# EAGLE design atx4vc (EAGLE 9.6.2)
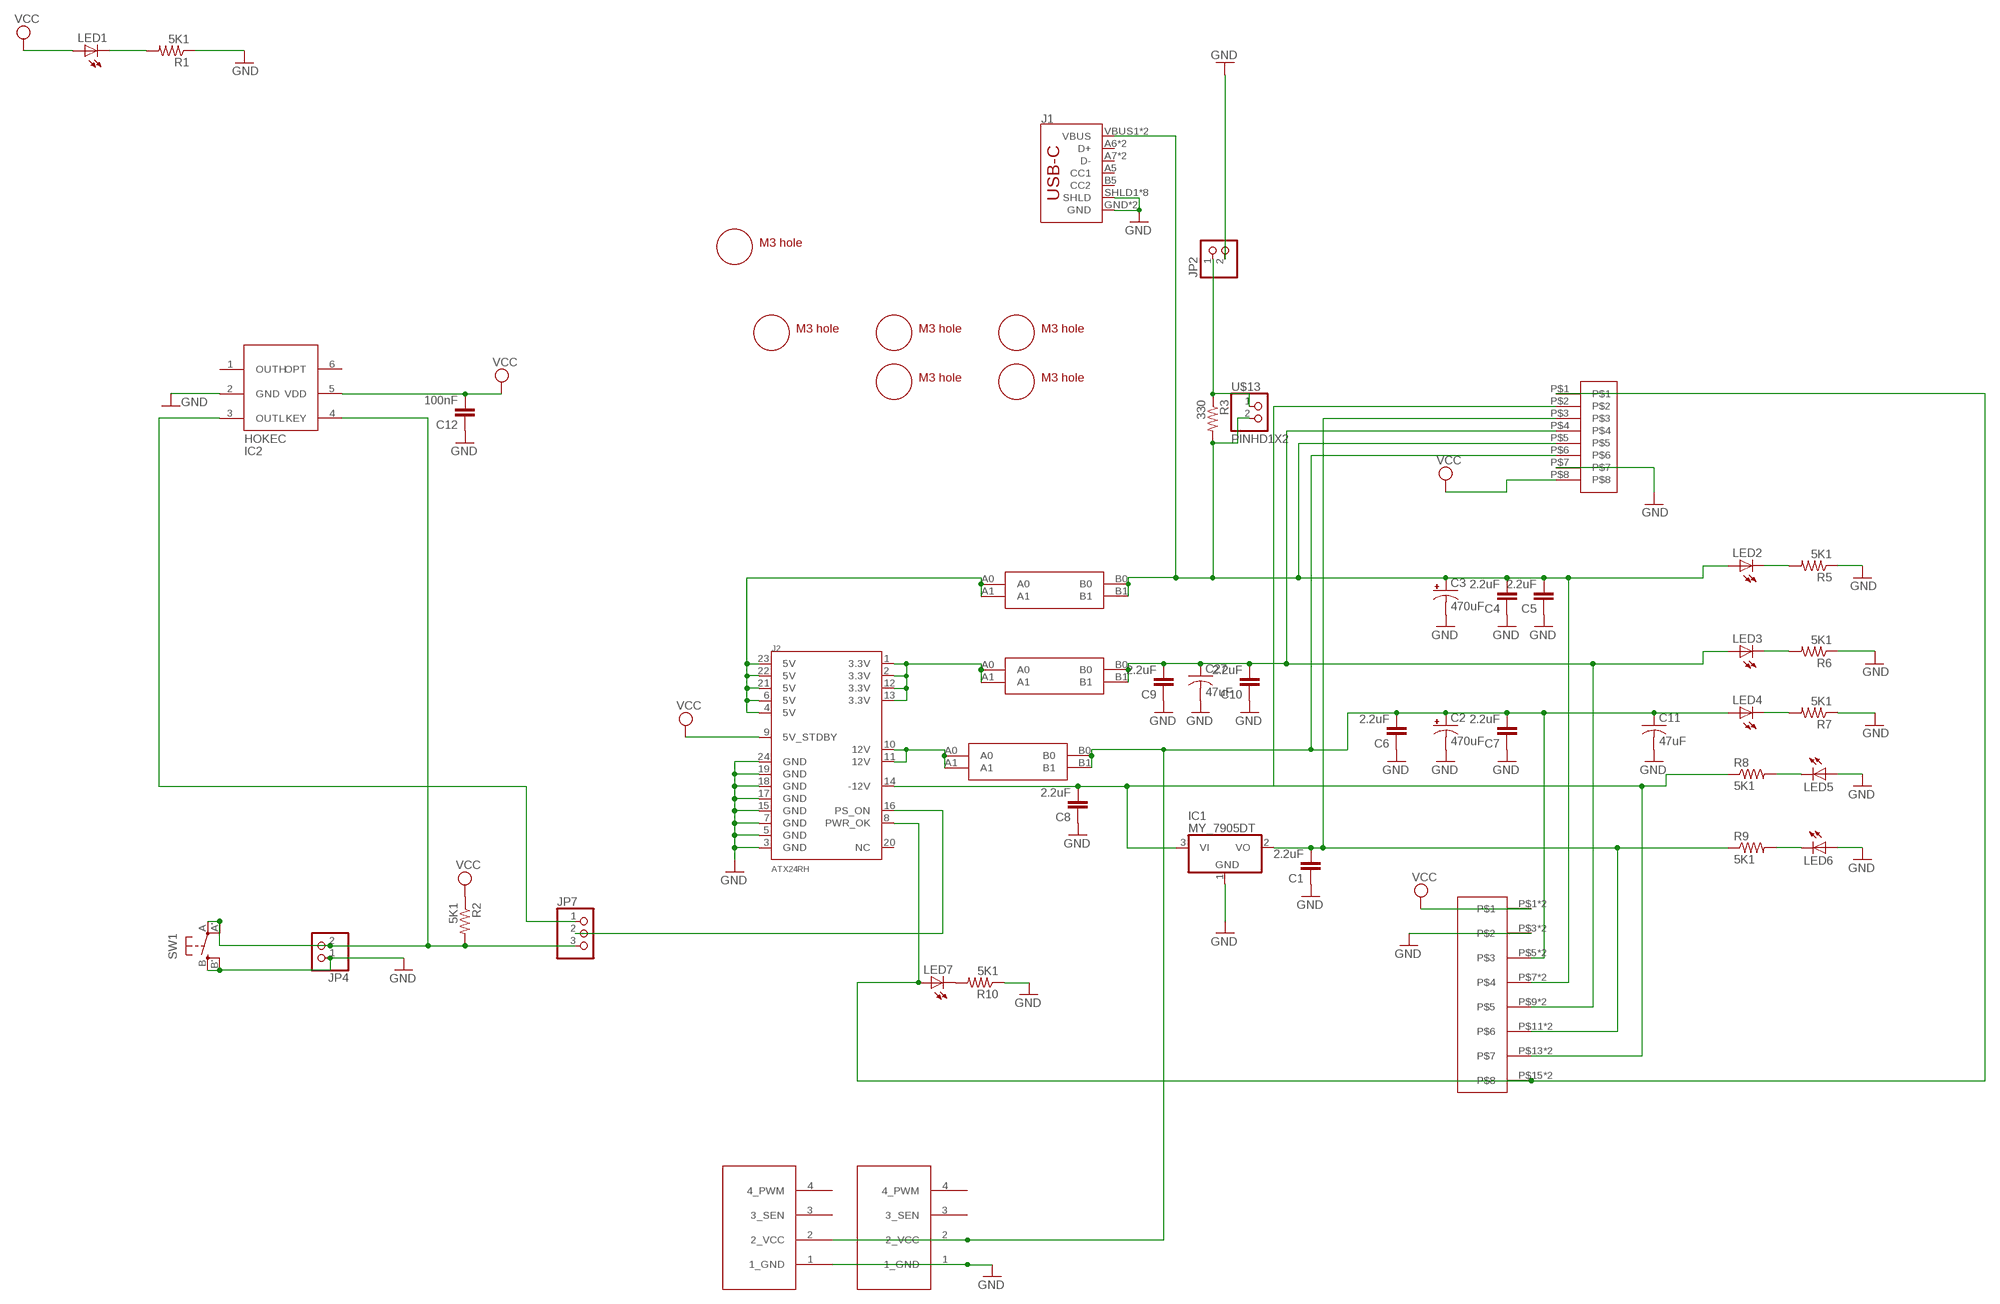
[diagram p0: schematic, sheet 1]

## Parts
C1  2.2uF  CAP0805  [0805$1]
C2  470uF  CPOL-USSMCD  [SMC_D]
C3  470uF  CPOL-USSMCD  [SMC_D]
C4  2.2uF  CAP0805  [0805$1]
C5  2.2uF  CAP0805  [0805$1]
C6  2.2uF  CAP0805  [0805$1]
C7  2.2uF  CAP0805  [0805$1]
C8  2.2uF  CAP0805  [0805$1]
C9  2.2uF  CAP0805  [0805$1]
C10  2.2uF  CAP0805  [0805$1]
C11  47uF  C-USC1210  [C1210]
C12  100nF  CAP0805  [0805$1]
C27  47uF  C-USC1210  [C1210]
IC1  MY_7905DT  [ADAFRUIT_TO252]
IC2  MAX486X/SOT  [SOT23-6]
J1  USB_C16PIN  [USB-C-16P]
J2  ATX24RH  [ATX24_RIGHT_ANGLE]
JP1  4PIN_FAN  [1X04]
JP2  PINHD-1X2  [1X02]
JP4  PINHD-1X2  [1X02]
JP5  4PIN_FAN  [1X04]
JP7  PINHD-1X3CB  [1X03-CLEANBIG]
LED1  LEDCHIP-LED0805  [CHIP-LED0805]
LED2  LEDCHIP-LED0805  [CHIP-LED0805]
LED3  LEDCHIP-LED0805  [CHIP-LED0805]
LED4  LEDCHIP-LED0805  [CHIP-LED0805]
LED5  LEDCHIP-LED0805  [CHIP-LED0805]
LED6  LEDCHIP-LED0805  [CHIP-LED0805]
LED7  LEDCHIP-LED0805  [CHIP-LED0805]
R1  5K1  RESISTOR0805-RES  [0805]
R2  5K1  RESISTOR0805-RES  [0805]
R3  330  RESISTOR0805-RES  [0805]
R5  5K1  RESISTOR0805-RES  [0805]
R6  5K1  RESISTOR0805-RES  [0805]
R7  5K1  RESISTOR0805-RES  [0805]
R8  5K1  RESISTOR0805-RES  [0805]
R9  5K1  RESISTOR0805-RES  [0805]
R10  5K1  RESISTOR0805-RES  [0805]
SW1  SPST_TACT-EVQQ2  [EVQ-Q2]
U$1  M3_MOUNTING_HOLE  [M3_MOUNTING_HOLE_PACK]
U$2  M3_MOUNTING_HOLE  [M3_MOUNTING_HOLE_PACK]
U$3  M3_MOUNTING_HOLE  [M3_MOUNTING_HOLE_PACK]
U$4  M3_MOUNTING_HOLE  [M3_MOUNTING_HOLE_PACK]
U$5  M3_MOUNTING_HOLE  [M3_MOUNTING_HOLE_PACK]
U$6  M3_MOUNTING_HOLE  [M3_MOUNTING_HOLE_PACK]
U$7  396_CONN_VH396_8P  [396_CONN_396_8P]
U$9  CAR_FUSE_HOLDER3IN1  [FUSE_HOLDER_3IN1]
U$10  CAR_FUSE_HOLDER3IN1  [FUSE_HOLDER_3IN1]
U$11  CAR_FUSE_HOLDER3IN1  [FUSE_HOLDER_3IN1]
U$12  DG2204R-5.0-8DG2204-8  [DG2204R-8]
U$13  PINHD1X2  [1X02]

## Nets
-5V: C1.2 IC1.2(VO) R9.1 U$7.P$3 U$12.P$11 U$12.P$12
-12V: C8.2 IC1.3(VI) J2.14(-12V) R8.1 U$7.P$2 U$12.P$13 U$12.P$14
F3V3: C9.2 C10.2 C27.1 LED3.A U$7.P$4 U$10.B0 U$10.B1 U$12.P$9 U$12.P$10
F5V: C3.+ C4.2 C5.2 J1.VBUS1(VBUS) J1.VBUS2(VBUS) LED2.A R3.2 U$7.P$5 U$9.B0 U$9.B1 U$12.P$7 U$12.P$8 U$13.2
F12V: C2.+ C6.2 C7.2 C11.1 JP1.2(2_VCC) JP5.2(2_VCC) LED4.A U$7.P$6 U$11.B0 U$11.B1 U$12.P$5 U$12.P$6
GND: C1.1 C2.- C3.- C4.1 C5.1 C6.1 C7.1 C8.1 C9.1 C10.1 C11.2 C12.1 C27.2 IC1.1(GND) IC2.2(GND) J1.GND J1.GND2(GND) J1.SHLD1(SHLD) J1.SHLD2(SHLD) J1.SHLD3(SHLD) J1.SHLD4(SHLD) J1.SHLD5(SHLD) J1.SHLD6(SHLD) J1.SHLD7(SHLD) J1.SHLD8(SHLD) J2.3(GND) J2.5(GND) J2.7(GND) J2.15(GND) J2.17(GND) J2.18(GND) J2.19(GND) J2.24(GND) JP1.1(1_GND) JP2.2 JP4.1 JP5.1(1_GND) LED5.A LED6.A R1.1 R5.1 R6.1 R7.1 R10.1 SW1.B'(S1) SW1.B(S) U$7.P$7 U$12.P$3 U$12.P$4
N$1: LED7.C R10.2
N$5: LED6.C R9.2
N$6: IC2.3(OUTL) JP7.1
N$8: LED5.C R8.2
N$9: LED4.C R7.2
N$10: J2.4(5V) J2.6(5V) J2.21(5V) J2.22(5V) J2.23(5V) U$9.A0 U$9.A1
N$11: J2.8(PWR_OK) LED7.A U$7.P$1 U$12.P$15 U$12.P$16
N$12: IC2.4(KEY) JP4.2 JP7.3 R2.2 SW1.A'(P1) SW1.A(P)
N$14: J2.1(3.3V) J2.2(3.3V) J2.12(3.3V) J2.13(3.3V) U$10.A0 U$10.A1
N$15: J2.16(PS_ON) JP7.2
N$17: JP2.1 R3.1 U$13.1
N$18: LED3.C R6.2
N$20: LED2.C R5.2
N$21: J2.10(12V) J2.11(12V) U$11.A0 U$11.A1
N$29: LED1.C R1.2
VCC: C12.2 IC2.5(VDD) J2.9(5V_STDBY) LED1.A R2.1 U$7.P$8 U$12.P$1 U$12.P$2
Unconnected: IC2.1(OUTH) IC2.6(OPT) J1.A5(CC1) J1.A6(D+) J1.A7(D-) J1.B5(CC2) J1.B6(D+) J1.B7(D-) J2.20(NC) JP1.3(3_SEN) JP1.4(4_PWM) JP5.3(3_SEN) JP5.4(4_PWM)

## Library data of the parts
C1 C4-C10 C12 = atx_power_control:CAP: Capacitor Standard 0603 ceramic capacitor, and 0.1" leaded capacitor.
C2 C3 = rcl:CPOL-US: POLARIZED CAPACITOR, American symbol; SPICEPREFIX: C
C11 C27 = clock:C-US: CAPACITOR, American symbol
IC1 = atx_power_control:MY_7905: Positive VOLTAGE REGULATOR Added bigger pads to the TO-92 package
IC2 = pmm:MAX486X
J1 = SparkFun-Connectors:USB_C: USB Type C 16Pin Connector Super Speed pins not available on the 16-pin purely SMD connector so this part is best for USB 2.0 implementations. D1 and D2 are tied together enabling D+/- no matter which way the cable is plugged into the connector. The two channel configuration pins (CC1/2) are exposed. These are normally connected to ground via 5.1k resistors but can be reconfigured for high current/high power applications.; PROD_ID: CONN-14122
J2 = nomcu:ATX24: ATX24 Pin Power Supply Connector This is a good connector for connecting a computer power supply to a PCB. It's massive, but provides many amps of power at 5V and 12V. SKU: PRT-09498
JP1 JP5 = appleii:4PIN_FAN: PIN HEADER
JP2 JP4 = pinhead:PINHD-1X2: PIN HEADER
JP7 = adafruit_changed:PINHD-1X3: PIN HEADER
LED1-LED7 = adafruit:LED: LED OSRAM: - CHIPLED LG R971, LG N971, LY N971, LG Q971, LY Q971, LO R971, LY R971 LH N974, LH R974 LS Q976, LO Q976, LY Q976 LO Q996 - Hyper CHIPLED LW Q18S LB Q993, LB Q99A, LB R99A - SideLED LS A670, LO A670, LY A670, LG A670, LP A670 LB A673, LV A673, LT A673, LW A673 LH A674 LY A675 LS A676, LA A676, LO A676, LY A676, LW A676 LS A679, LY A679, LG A679 - Hyper Micro SIDELED® LS Y876, LA Y876, LO Y876, LY Y876 LT Y87S - SmartLED LW L88C, LW L88S LB L89C, LB L89S, LG L890 LS L89K, LO L89K, LY L89K LS L896, LA L896, LO L896, LY L896 - TOPLED LS T670, LO T670, LY T670, LG T670, LP T670 LSG T670, LSP T670, LSY T670, LOP T670, LYG T670 LG T671, LOG T671, LSG T671 LB T673, LV T673, LT T673, LW T673 LH T674 LS T676, LA T676, LO T676, LY T676, LB T676, LH T676, LSB T676, LW T676 LB T67C, LV T67C, LT T67C, LS T67K, LO T67K, LY T67K, LW E67C LS E67B, LA E67B, LO E67B, LY E67B, LB E67C, LV E67C, LT E67C LW T67C LS T679, LY T679, LG T679 LS T770, LO T770, LY T770, LG T770, LP T770 LB T773, LV T773, LT T773, LW T773 LH T774 LS E675, LA E675, LY E675, LS T675 LS T776, LA T776, LO T776, LY T776, LB T776 LHGB T686 LT T68C, LB T68C - Hyper Mini TOPLED® LB M676 - Mini TOPLED Santana® LG M470 LS M47K, LO M47K, LY M47K Source: http://www.osram.convergy.de/
R1-R3 R5-R7 R10 = atx_power_control:RESISTOR: Resistor Basic schematic elements and footprints for 0603, 1206, and PTH resistors.
R8 R9 = SparkFun-Passives:RESISTOR: Resistor Basic schematic elements and footprints for 0603, 1206, and PTH resistors.
SW1 = duckypad:SPST_TACT: SMT 6mm switch, EVQQ2 series http://www.ladyada.net/library/eagle
U$1-U$6 = a:M3_MOUNTING_HOLE
U$7 = atx4vc:396_CONN_VH396_8P
U$9-U$11 = atx_power_control:CAR_FUSE_HOLDER
U$12 = atx4vc:DG2204R-5.0-8
U$13 = adafruit_changed:PINHD1X2

## Board
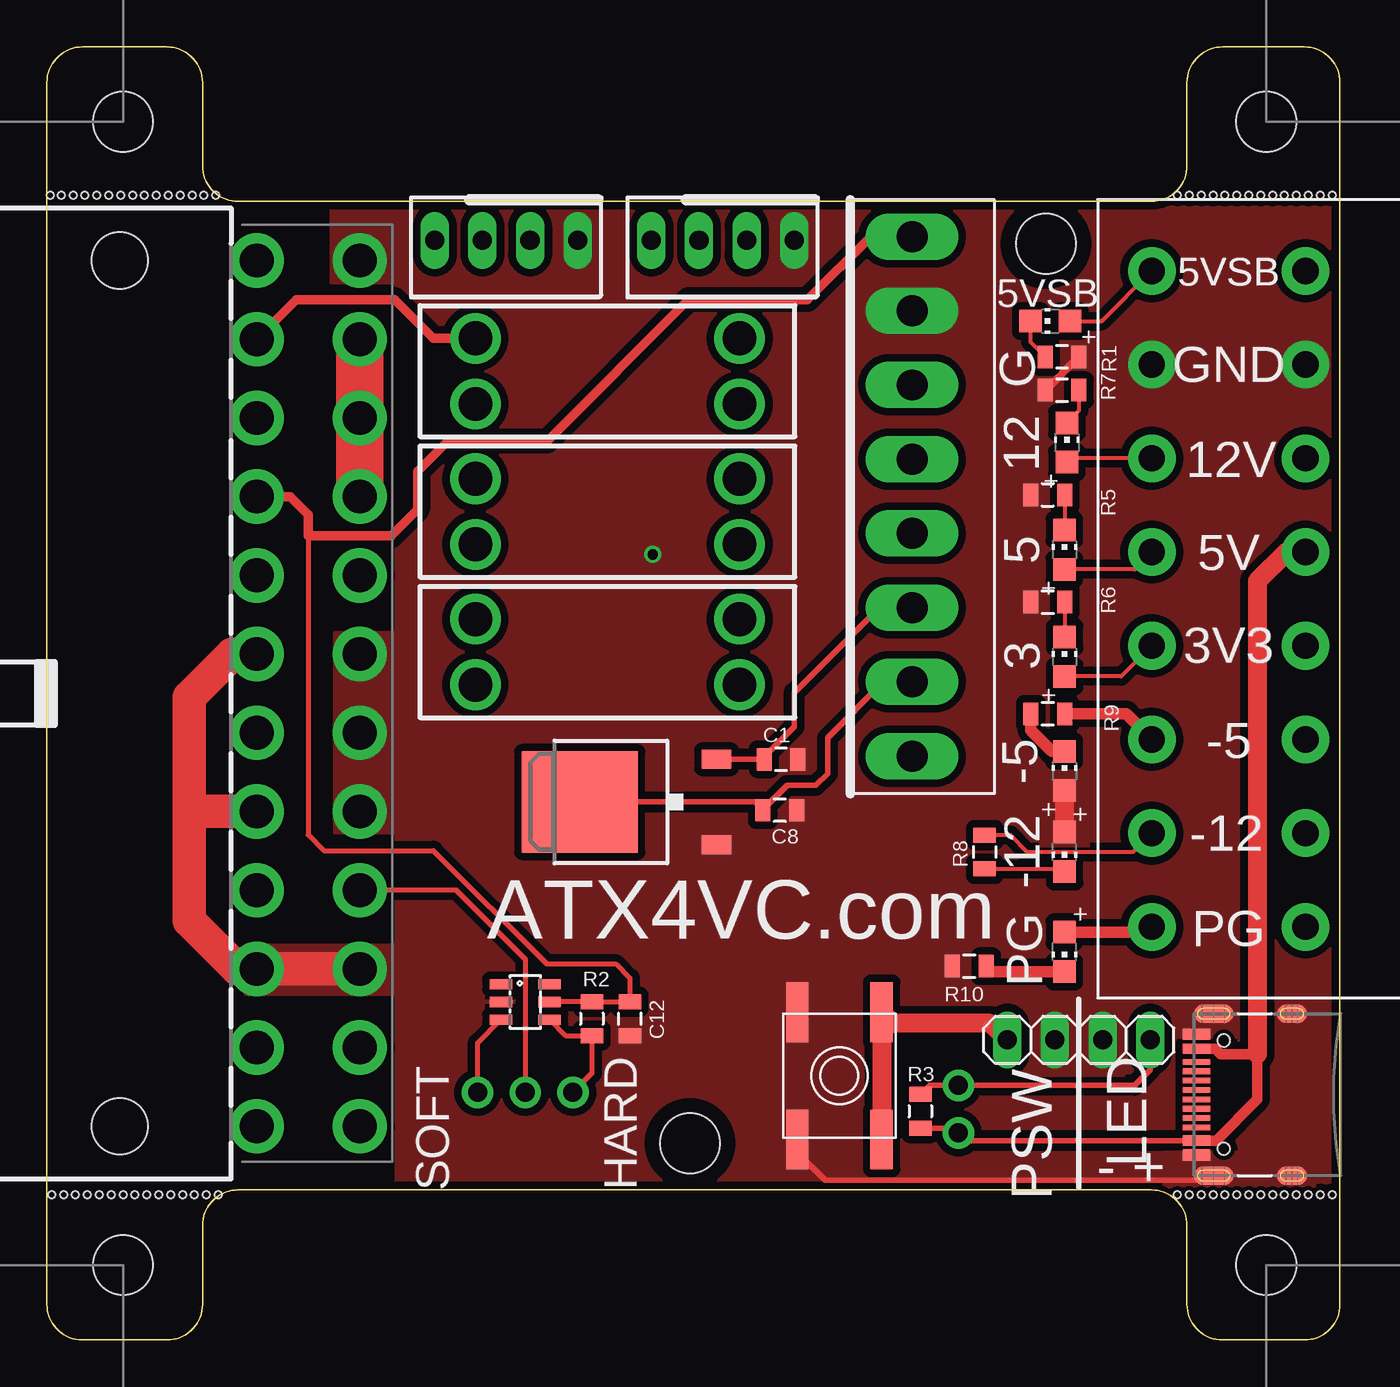
[diagram p1: board, top side]
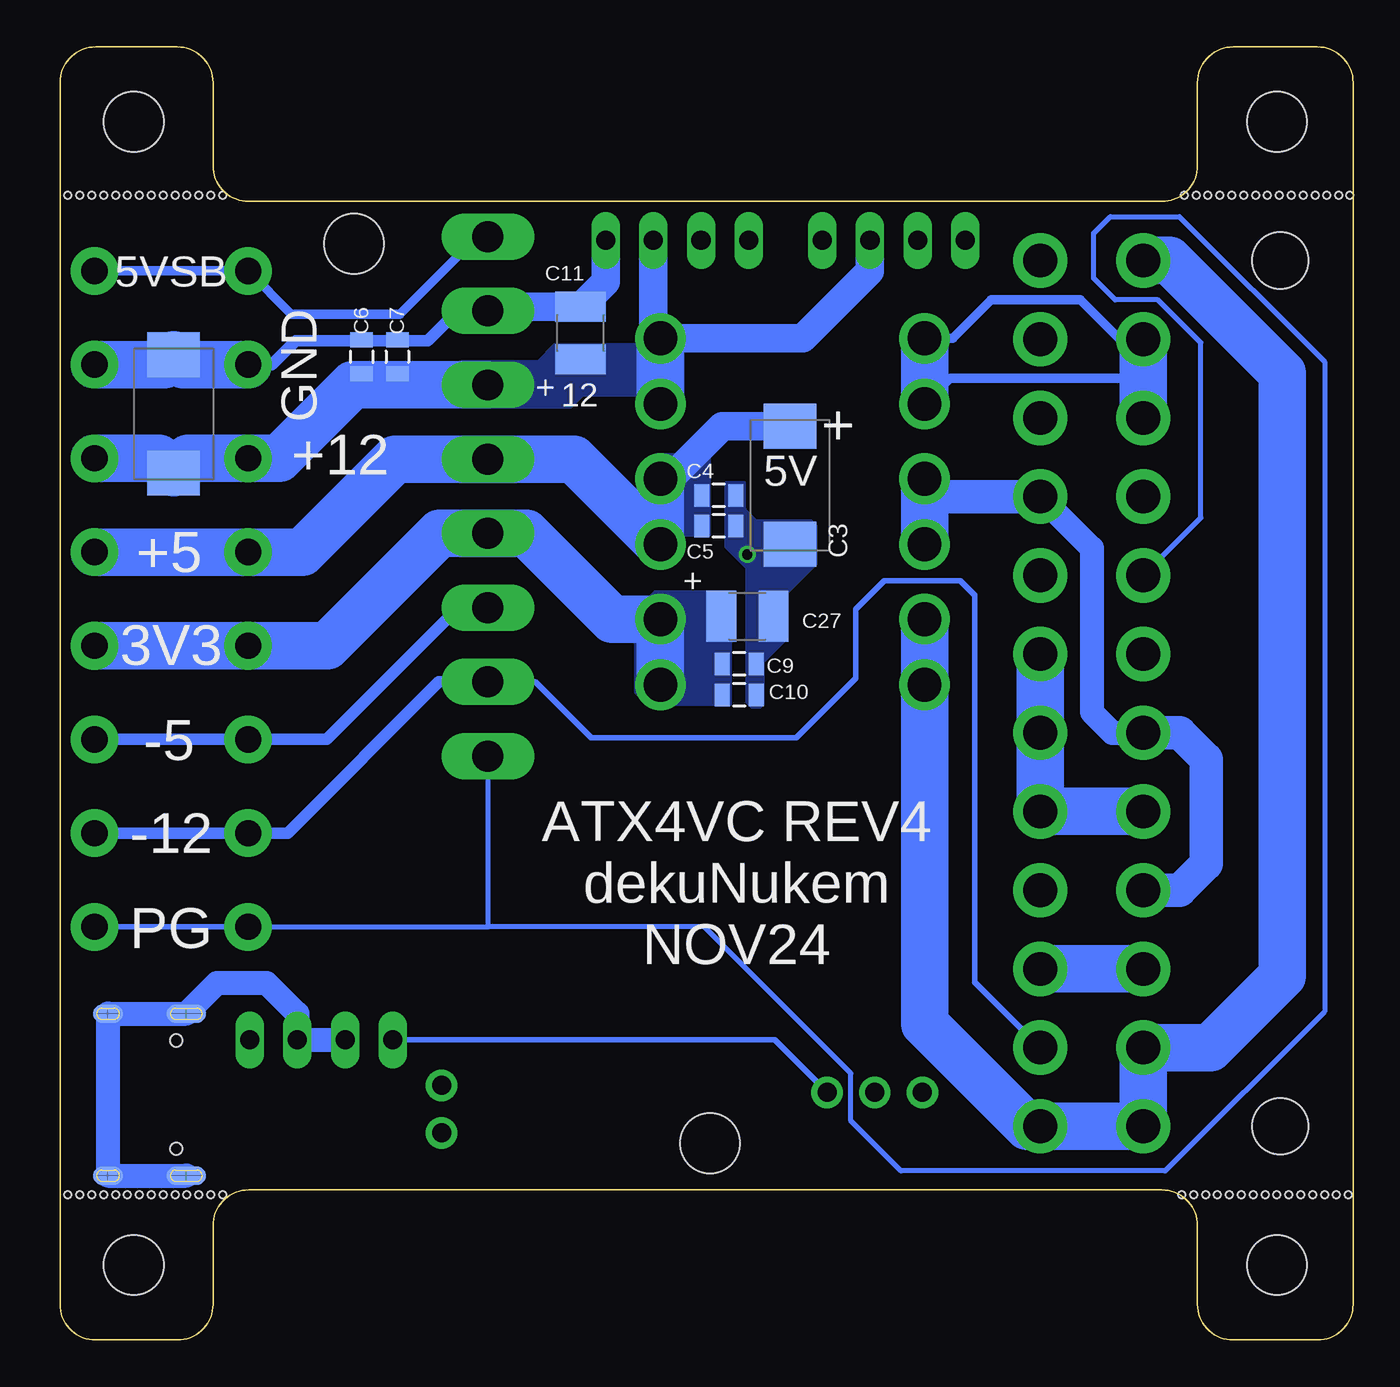
[diagram p2: board, bottom side, seen from below]

Size 69 x 69 mm. Coordinates in mm from the lower left corner, seen from the top.
Outline: 10.21,60.75 58.93,60.75 arc90 60.83,62.66 60.83,67.09 arc-90 62.74,69 67.09,69 arc-90 69,67.09 69,1.91 arc-90 67.09,0 62.74,0 arc-90 60.83,1.91 60.83,6.1 arc90 58.93,8.01 10.21,8.01 arc90 8.31,6.1 8.31,1.91 arc-90 6.4,0 1.91,0 arc-90 0,1.91 0,67.09 arc-90 1.91,69 6.4,69 arc-90 8.31,67.09 8.31,62.66 arc90 10.21,60.75
Copper layers (1*16): Top 0.035mm / dielectric 1.5mm / Bottom 0.035mm
Design rules "deku_2layer_6mil": minimum track width 6mil, minimum drill 15mil, track to track 6mil, track to pad 6mil, pad to pad 6mil, via to via 6mil, smd to smd 6mil, copper to edge 10mil, drill to drill 6mil, minimum pad ring 7mil, minimum via ring 7mil, stop-mask expansion 4mil, vias tented up to drill 25mil, thermal gap 10mil
Holes 0.38 mm at 0.18,61.09 0.76,61.09 1.4,61.09 2.03,61.09 2.67,61.09 3.3,61.09 3.94,61.09 4.57,61.09 5.21,61.09 5.84,61.09 6.48,61.09 7.11,61.09 7.75,61.09 8.38,61.09 0.25,7.75 0.89,7.75 1.52,7.75 2.16,7.75 2.79,7.75 3.43,7.75 4.06,7.75 4.7,7.75 5.33,7.75 5.97,7.75 6.6,7.75 7.24,7.75 7.87,7.75 8.51,7.75 60.33,7.75 60.96,7.75 61.59,7.75 62.23,7.75 62.87,7.75 63.5,7.75 64.14,7.75 64.77,7.75 65.41,7.75 66.04,7.75 66.67,7.75 67.31,7.75 67.94,7.75 68.58,7.75 60.96,61.09 61.59,61.09 62.23,61.09 62.87,61.09 63.5,61.09 64.14,61.09 64.77,61.09 65.41,61.09 66.04,61.09 66.67,61.09 67.31,61.09 67.94,61.09 68.58,61.09 9.14,7.75 9.02,61.09 60.33,61.09
tRestrict: area 0,0 to 8,8; area 0,60.9 to 8,68.9; area 61.1,61.1 to 69.1,69.1; area 61.1,0 to 69.1,8
bRestrict: area 0,0 to 8,8; area 61.1,0 to 69.1,8; area 0,60.9 to 8,68.9; area 61.1,61.1 to 69.1,69.1

### Footprints (pad centres in the part's own frame; a part is rotated, then mirrored left to right if it is on the bottom)
0805$1 = smd 0.8 x 1.2: 1 -0.9,0; 2 0.9,0
SMC_D = smd 2.4 x 2.8: + -3.15,0; - 3.15,0
C1210 = smd 1.6 x 2.7: 1 -1.4,0; 2 1.4,0
ADAFRUIT_TO252 = smd 1 x 1.6: 1 -2.28,-4.8; 2 2.28,-4.8 | smd 5.4 x 6.2: 3 0,2.5
SOT23-6 = smd 0.55 x 1.2: 1 -0.95,-1.3; 2 0,-1.3; 3 0.95,-1.3; 4 0.95,1.3; 5 0,1.3; 6 -0.95,1.3
USB-C-16P = smd 0.3 x 1.45: A5 -1.25,0; A6 -0.25,0; A7 0.25,0; A8 1.25,0; B5 1.75,0; B6 0.75,0; B7 -0.75,0; B8 -1.75,0 | smd 0.6 x 1.45: GND -3.225,0; GND2 3.225,0 | smd 1 x 2.1: SHLD1 -4.32,-0.915; SHLD2 4.32,-0.915 | smd 1 x 2.1 bottom: SHLD3 -4.32,-0.915; SHLD4 4.32,-0.915 | smd 1 x 1.6: SHLD5 -4.32,-5.095; SHLD8 4.32,-5.095 | smd 1 x 1.6 bottom: SHLD6 -4.32,-5.095; SHLD7 4.32,-5.095 | smd 0.55 x 1.45: VBUS1 -2.45,0; VBUS2 2.45,0 | hole 0.65: -2.89,-1.445; 2.89,-1.445
ATX24_RIGHT_ANGLE = drill 1.8 pad 2.9: 1 23.1,4.76; 2 18.9,4.76; 3 14.7,4.76; 4 10.5,4.76; 5 6.3,4.76; 6 2.1,4.76; 7 -2.1,4.76; 8 -6.3,4.76; 9 -10.5,4.76; 10 -14.7,4.76; 11 -18.9,4.76; 12 -23.1,4.76; 13 23.1,10.26; 14 18.9,10.26; 15 14.7,10.26; 16 10.5,10.26; 17 6.3,10.26; 18 2.1,10.26; 19 -2.1,10.26; 20 -6.3,10.26; 21 -10.5,10.26; 22 -14.7,10.26; 23 -18.9,10.26; 24 -23.1,10.26 | hole 3: -23.1,-2.54; 23.1,-2.54
1X04 = drill 1.016 long: 1 -3.81,0; 2 -1.27,0; 3 1.27,0; 4 3.81,0
1X02 = drill 1.016 long: 1 -1.27,0; 2 1.27,0
1X03-CLEANBIG = drill 1.016 pad 1.676: 1 -2.54,0; 2 0,0; 3 2.54,0
CHIP-LED0805 = smd 1.2 x 1.2: A 0,-1.05; C 0,1.05
0805 = smd 0.8 x 1.2: 1 -0.9,0; 2 0.9,0
EVQ-Q2 = smd 3.2 x 1.2: A -3.4,-2.25; A' 3.4,-2.25; B -3.4,2.25; B' 3.4,2.25
M3_MOUNTING_HOLE_PACK = hole 3.2: 0,0
396_CONN_396_8P = drill 1.65 long: P$1 -11.88,0; P$2 -7.92,0; P$3 -3.96,0; P$4 0,0; P$5 3.96,0; P$6 7.92,0; P$7 11.88,0; P$8 15.84,0
FUSE_HOLDER_3IN1 = drill 1.8: A0 -7.05,1.75; A1 -7.05,-1.75; B0 7.05,1.75; B1 7.05,-1.75
DG2204R-8 = drill 1.4 pad 2.54: P$1 -15,4.1; P$2 -15,-4.1; P$3 -10,4.1; P$4 -10,-4.1; P$5 -5,4.1; P$6 -5,-4.1; P$7 0,4.1; P$8 0,-4.1; P$9 5,4.1; P$10 5,-4.1; P$11 10,4.1; P$12 10,-4.1; P$13 15,4.1; P$14 15,-4.1; P$15 20,4.1; P$16 20,-4.1
1X02' = drill 1.016 pad 1.676: 1 -1.27,0; 2 1.27,0

### Placement (x,y rotation side)
C1  39.17,30.98 180 top
C2  62.94,49.41 90 bottom
C3  30.04,45.6 270 bottom
C4  33.85,45.07 180 bottom
C5  33.85,43.44 180 bottom
C6  52.9,52.46 270 bottom
C7  51,52.46 270 bottom
C8  39.11,28.27 180 top
C9  32.76,36.08 180 bottom
C10  32.76,34.42 180 bottom
C11  41.22,53.73 90 bottom
C12  31.11,17.14 90 top
C27  32.33,38.62 0 bottom
IC1  30.93,28.71 90 top
IC2  25.53,18.03 270 top
J1  61.35,13.09 90 top
J2  6.44,34.5 270 top
JP1  24.51,58.67 180 top
JP2  57.6,16.01 180 top
JP4  52.52,16.01 180 top
JP5  36.07,58.67 180 top
JP7  25.53,13.21 0 top
LED1  53.54,54.36 90 top
LED2  54.3,42.17 0 top
LED3  54.3,36.46 0 top
LED4  54.43,47.89 0 top
LED5  54.3,26.04 180 top
LED6  54.3,30.36 0 top
LED7  54.3,20.71 180 top
R1  54.17,52.46 180 top
R2  29.08,17.14 270 top
R3  46.62,12.2 270 top
R5  53.41,45.09 0 top
R6  53.41,39.38 0 top
R7  54.17,50.68 0 top
R8  50.04,26.04 270 top
R9  53.41,33.41 180 top
R10  49.22,19.95 0 top
SW1  42.29,14.1 90 top
U$1  34.32,10.5 0 top
U$2  53.32,58.5 0 top
U$3  4.07,65 0 top
U$4  4.07,4 0 top
U$5  65.07,65 0 top
U$6  65.07,4 0 top
U$7  46.17,43.04 90 top
U$9  29.92,44.2 0 top
U$10  29.92,36.71 0 top
U$11  29.92,51.7 0 top
U$12  63.06,42.05 270 top
U$13  PINHD1X2  [1X02']  48.64,12.32 270 top

### Tracks (layer width: path | path; a pad name or v marks a point on that pad's centre or on a via)
-5V
  Top 0.305: IC1.2 35.78,30.94 35.82,30.98 C1.2 38.27,31.11 39.88,32.72 39.88,34.54 44.41,39.08 U$7.P$3
  Top 0.61: R9.1 57.6,33.41 U$12.P$12
  Bottom 0.61: U$12.P$11 U$12.P$12 54.78,32.05 47.74,39.08 U$7.P$3
-12V
  Top 0.203: U$12.P$14 57.95,26.04 52.32,26.04 51.42,26.93 R8.1
  Top 0.305: IC1.3 37.76,28.71 C8.2 38.21,28.3 39.5,29.59 41.02,29.59 41.66,30.23 41.66,32.13 44.64,35.12 U$7.P$2
  Bottom 0.305: J2.14 20.19,19.1 20.19,39.75 20.95,40.51 25.02,40.51 26.54,38.99 26.54,35.31 29.72,32.13 40.65,32.13 43.63,35.12 U$7.P$2
  Bottom 0.61: U$12.P$13 U$12.P$14 56.85,27.05 48.78,35.12 U$7.P$2
F3V3
  Top 0.203: U$12.P$10 57.33,35.41 LED3.A
  Bottom 2.54: U$10.B1 U$10.B0 39.54,38.46 44.12,43.04 U$7.P$4 48.74,43.04 54.73,37.05 U$12.P$10 U$12.P$9
  pour Bottom (no thermals): 33.22,39.89 37.28,39.89 38.3,38.87 38.3,34.55 37.66,33.92 33.22,33.92
F5V
  Top 0.203: U$12.P$8 58.04,41.12 LED2.A
  Top 0.305: J1.VBUS1 49.05,10.64 U$13.2 48.39,11.3 R3.2
  Top 0.559: J1.VBUS1 62.39,10.64 64.59,12.84 64.59,15.25 62.63,15.25 62.34,15.54 J1.VBUS2
  Top 1.016: U$12.P$7 66.15,42.05 64.59,40.48 64.59,15.25
  Bottom 1.524: U$9.B0 36.46,45.95 33.66,48.75 C3.+
  Bottom 2.54: U$9.B0 U$9.B1 37.06,42.45 41.6,47 U$7.P$5 51.13,47 56.08,42.05 U$12.P$8 U$12.P$7
  pour Bottom (no thermals): 34.36,47.25 34.36,42.93 37.16,42.93 37.16,47.25
F12V
  Top 0.203: U$12.P$6 54.63,47.05 LED4.A
  Bottom 0.203: C6.2 C7.2 50.4,50.96 U$7.P$6
  Bottom 1.524: JP5.2 37.34,53.82 U$11.B0 29.36,53.45 25.78,57.02 JP1.2
  Bottom 2.54: U$11.B0 U$11.B1 | U$7.P$6 53.39,50.96 57.3,47.05 U$12.P$6 62.15,47.05 C2.+ 63.72,47.05 U$12.P$5
  pour Bottom (no thermals): 42.62,53.09 43.51,52.2 47.57,52.2 47.57,49.79 41.73,49.79 41.09,50.43 35.76,50.43 35.76,53.09
GND  (via drill 0.55)
  Top 0.305: J1.SHLD3 62,8.51 41.53,8.51 40.04,10 SW1.B
  Top 0.406: R1.1 53.29,50.68 R7.1
  Top 1.016: LED6.A LED5.A
  Top 1.778: J2.7 9.9,36.6 7.6,34.3 7.6,28.2 | J2.15 J2.3 10.16,19.8 7.6,22.36 7.6,28.2 | J2.5 7.6,28.2
  Bottom 0.203: C6.1 C7.1 49.41,53.36 49.37,53.32
  Bottom 0.61: U$12.P$4 57.69,52.05 56.42,53.32 49.37,53.32 47.78,54.92 U$7.P$7
  Bottom 1.27: J1.SHLD3 J1.SHLD5 J1.SHLD8 J1.SHLD4 60.61,19.06 57.98,19.06 56.33,17.41 JP2.2 JP4.1
  Bottom 1.524: U$7.P$7 45.96,55.13 C11.2 39.88,56.47 JP5.1
  Bottom 2.54: U$12.P$4 62.42,52.05 C2.- 63.45,52.05 U$12.P$3 | J2.5 J2.17 J2.18 J2.19 | J2.3 J2.15
  other vias: 32.33,41.92
  pour Top (isolate 0.406): 18.61,8.01 69.31,8.01 69.31,60.74 18.61,60.74
  pour Top (isolate 0.406): 15.34,37.73 15.34,27.06 19.12,27.06 19.12,37.73
  pour Top (no thermals): 60.4,18.17 63.57,18.17 63.57,16.14 60.4,16.14
  pour Top (no thermals): 65.6,15.5 65.6,18.68 67.64,18.68 67.64,15.5
  pour Top (no thermals): 67.64,8.01 59.63,8.01 59.63,10.04 67.64,10.04
  pour Top (isolate 0.406, no thermals): 19.12,56.4 15.18,56.4 15.18,60.33 19.12,60.33
  pour Top (no thermals): 52.65,14.11 52.65,18.3 57.48,18.3 57.48,14.11
  pour Top (isolate 0.406, no thermals): 21.03,18.42 10.61,18.42 10.61,21.09 21.03,21.09
  pour Top (no thermals): 55.57,30.36 55.57,26.17 53.03,26.17 53.03,30.36
  pour Bottom (no thermals): 33.47,45.73 33.47,42.3 32.35,41.17 32.35,34.02 32.12,33.79 31.61,33.79 31.49,33.92 31.49,36.16 30.17,37.47 30.17,39.89 28.65,41.41 28.65,43.44 28.9,43.7 31.82,43.7 32.46,44.33 32.46,45.73
  pour Top (isolate 0.406, no thermals): 40.89,19.5 40.89,8.45 39.11,8.45 39.11,19.5
N$1
  Top 0.61: R10.2 50.41,19.66 LED7.C
N$5
  Top 0.61: R9.2 52.51,32.53 53.63,31.41 LED6.C
N$6
  Top 0.254: JP7.1 22.99,15.84 IC2.3
N$8
  Top 0.203: R8.2 54.16,25.14 54.27,25.03
  Top 0.61: 54.27,25.03 LED5.C
N$9
  Top 0.203: R7.2 55.07,49.59 LED4.C
N$10
  Top 2.54: J2.23 J2.22 J2.21
  Bottom 1.27: J2.21 13.95,42.25 13.95,33.5 12.85,32.4 J2.6
  Bottom 1.778: J2.21 21.91,45 U$9.A0 | J2.6 9.26,32.4 7.85,31 7.85,25.41 9.26,24 J2.4
  Bottom 2.54: U$9.A0 U$9.A1
N$11
  Top 0.61: LED7.A 58.68,21.76 U$12.P$16
  Bottom 0.254: J2.8 8.13,43.87 8.13,53.21 10.41,55.5 12.7,55.5 13.84,56.64 13.84,59.05 12.95,59.94 9.27,59.94 1.52,52.2 1.52,17.53 10.03,9.02 24.13,9.02 26.8,11.68 26.8,14.22 34.62,22.05 46.18,22.05 | U$7.P$1 46.17,22.05 46.18,22.05 | U$12.P$16 46.18,22.05
  Bottom 0.305: U$12.P$16 U$12.P$15
N$12
  Top 0.254: IC2.4 27.67,16.25 R2.2 29.08,14.22 JP7.3
  Top 1.016: SW1.A SW1.A' 45.14,16.9 50.36,16.9 JP4.2
  Bottom 0.305: JP7.3 30.87,16.01 JP4.2
N$14
  Bottom 2.54: J2.12 9.8,57.6 3.79,51.59 3.79,19.44 7.62,15.6 J2.2 J2.1 J2.13 17.38,11.4 22.87,16.89 U$10.A1 U$10.A0
N$15
  Top 0.254: J2.16 21.85,24 25.53,20.32 JP7.2
N$17
  Top 0.305: JP2.1 58.87,14.42 58.04,13.59 U$13.1 47.1,13.59 R3.1
N$18
  Top 0.203: LED3.C 54.31,37.52 R6.2
N$20
  Top 0.203: R5.2 54.31,43.23 LED2.C
N$21
  Top 0.508: J2.11 13.3,55.51 18.55,55.51 20.61,53.45 U$11.A0
  Bottom 0.508: J2.11 12.47,53.4 14.57,55.51 19.31,55.51 21.38,53.45 U$11.A0 | U$11.A1 21.5,51.32 11.2,51.32
  Bottom 2.54: J2.11 11.2,51.32 J2.10 | U$11.A0 U$11.A1
N$29
  Top 0.203: R1.2 52.49,53.24 LED1.C
VCC
  Top 0.203: LED1.A 56.28,54.36 U$12.P$2
  Top 0.254: 13.95,42.91 13.95,26.95 14.78,26.11 20.62,26.11 26.67,20.07 30.35,20.07 31.11,19.3 C12.2 R2.1 26.84,18.05 IC2.5
  Top 0.508: J2.9 12.97,45 13.95,44.03 13.95,42.91 18.37,42.91 19.79,44.33 19.79,46.36 21.39,47.96 26.69,47.96 34.23,55.51 40.58,55.51 43.96,58.88 U$7.P$8
  Bottom 0.508: U$12.P$1 U$12.P$2 56.66,54.74 50.87,54.74 46.74,58.88 U$7.P$8

### Text on the board
tNames: MAKE SURE TO USE / 12V RATED CAPS ON 12V LINES | 5VSB | 5VSB | 5VSB | G | GND | 12 | 12V | 5 | 5V | 3 | 3V3 | -5 | -5 | -12 | -12 | ATX4VC.com | PG | PG | HARD | LED | SOFT | PSW | - +
bNames: 5VSB | GND | 12 | + | +12 | 5V | +5 | 3V3 | -5 | -12 | ATX4VC REV4 / dekuNukem / NOV24 | PG
tDocu: header as switch / 5mm from edge